# EAGLE design SparkFun_TC78H670FTG_Breakout (EAGLE 9.5.2)
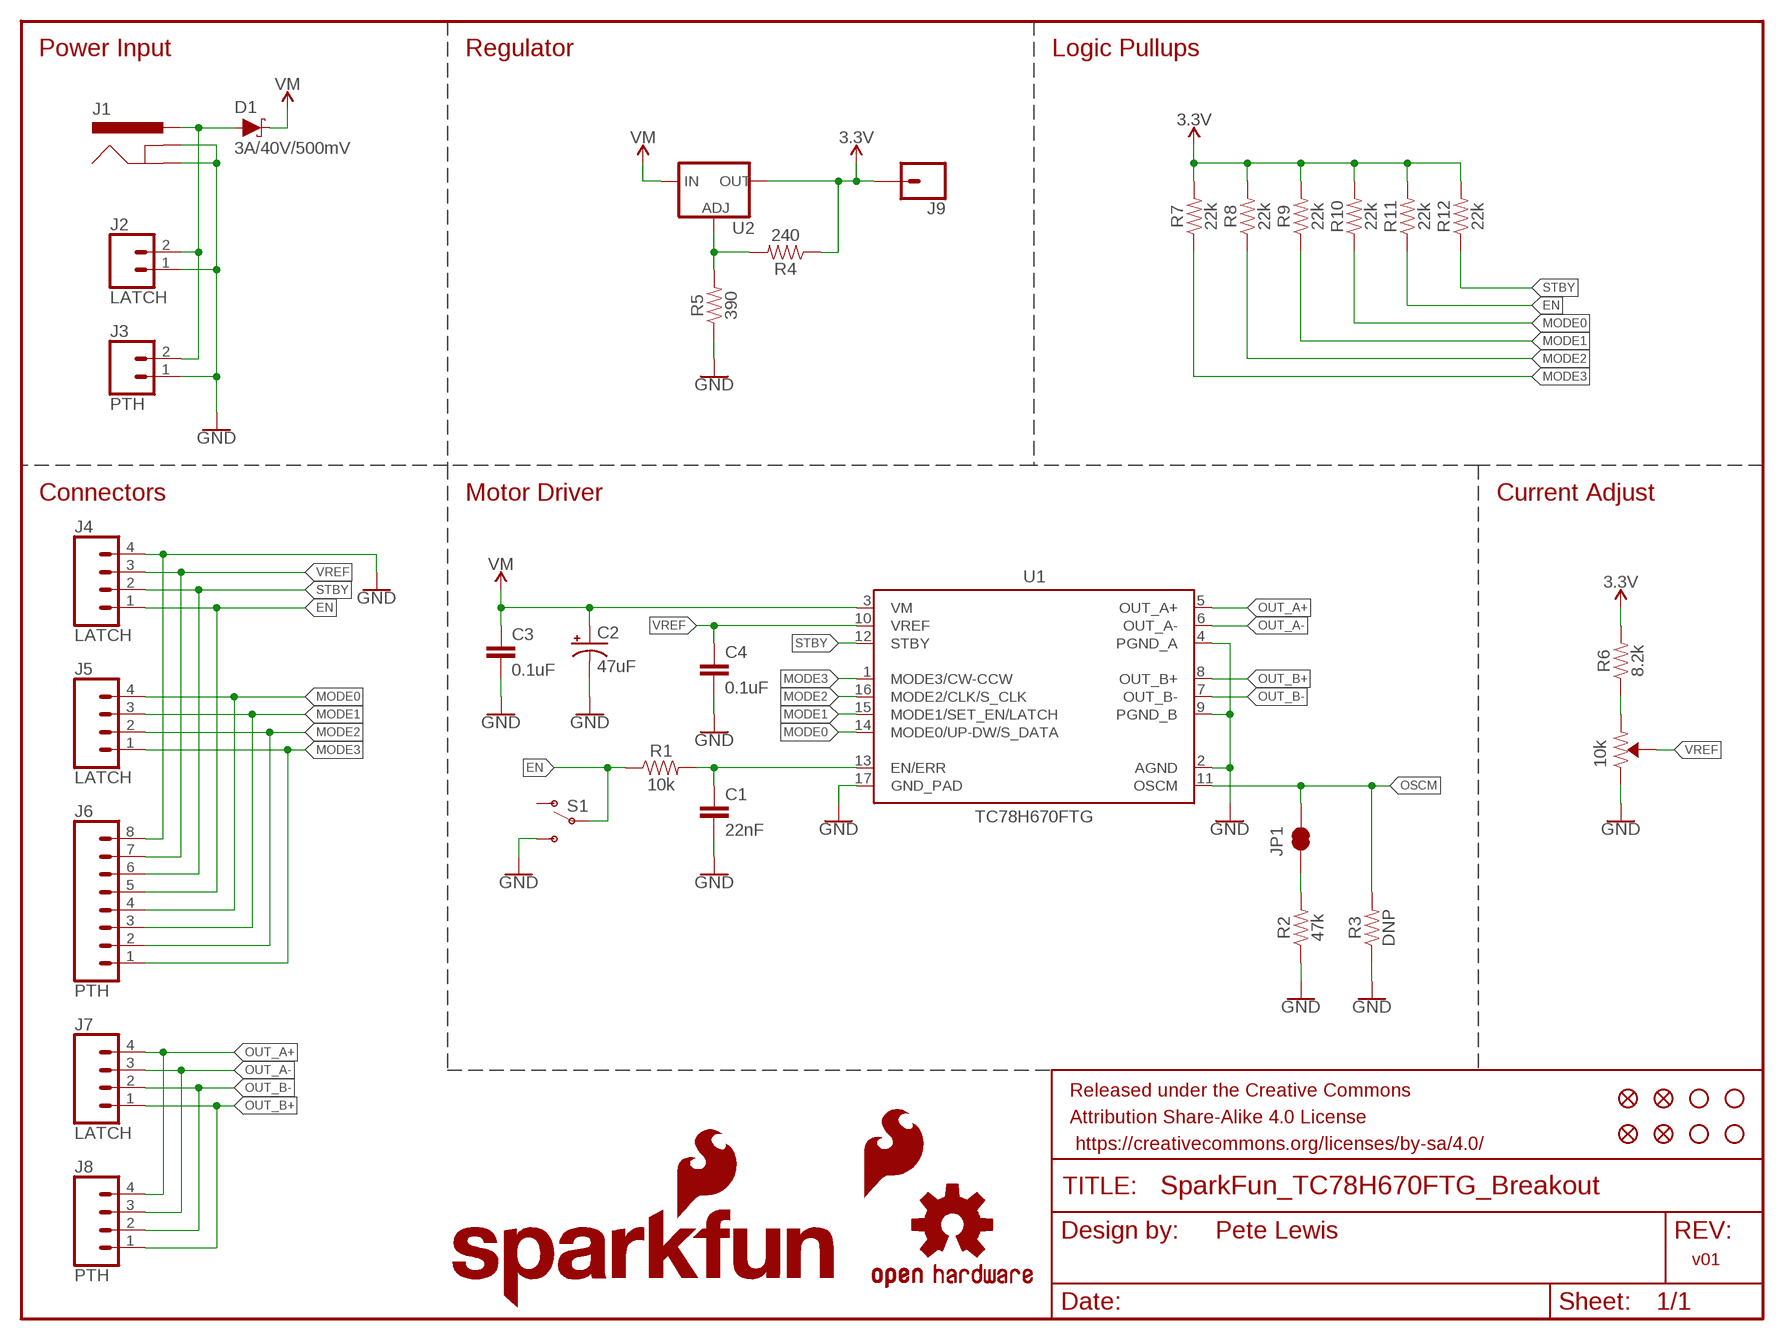
[diagram p0: schematic, sheet 1]

## Parts
C1  22nF  22NF/22,000PF-0603-50V-10%  [0603]
C2  47uF  47UF-POLAR-PANASONIC_D-35V-20%  [PANASONIC_D]
C3  0.1uF  0.1UF-0603-25V-(+80/-20%)  [0603]
C4  0.1uF  0.1UF-0603-25V-(+80/-20%)  [0603]
D1  3A/40V/500mV  DIODE-SCHOTTKY-B340A  [SMA-DIODE]
FID1  FIDUCIAL1X2  [FIDUCIAL-1X2]
FID2  FIDUCIAL1X2  [FIDUCIAL-1X2]
FID3  FIDUCIAL1X2  [FIDUCIAL-1X2]
FID4  FIDUCIAL1X2  [FIDUCIAL-1X2]
FRAME1  FRAME-LETTER  [CREATIVE_COMMONS]
J1  POWER_JACKTOE  [POWER_JACK_SMD_OVERPASTE_TOE]
J2  LATCH  CONN_02LATCH_2  [LATCHTERMINAL-5MM-2]
J3  PTH  CONN_021X02_NO_SILK  [1X02_NO_SILK]
J4  LATCH  CONN_04LATCH  [LATCHTERMINAL-5MM-4]
J5  LATCH  CONN_04LATCH  [LATCHTERMINAL-5MM-4]
J6  PTH  CONN_08NO_SILK_FEMALE_PTH  [1X08_NO_SILK]
J7  LATCH  CONN_04LATCH  [LATCHTERMINAL-5MM-4]
J8  PTH  CONN_041X04_NO_SILK  [1X04_NO_SILK]
J9  CONN_01PTH_NO_SILK_YES_STOP  [1X01_NO_SILK]
JP1  JUMPER-SMT_2_NC_TRACE_SILK  [SMT-JUMPER_2_NC_TRACE_SILK]
LOGO1  SFE_LOGO_NAME_FLAME.1_INCH  [SFE_LOGO_NAME_FLAME_.1]
LOGO2  OSHW-LOGOS  [OSHW-LOGO-S]
LOGO4  SFE_LOGO_FLAME.1_INCH  [SFE_LOGO_FLAME_.1]
R1  10k  10KOHM-0603-1/10W-1%  [0603]
R2  47k  47KOHM-0603-1/10W-1%  [0603]
R3  DNP  RESISTORAXIAL-0.3  [AXIAL-0.3]
R4  240  240OHM-0603-1/10W-1%  [0603]
R5  390  390OHM-0603-1/10W-1%  [0603]
R6  8.2k  8.2KOHM-0603-1/10W-5%  [0603]
R7  22k  22KOHM-0603-1/10W-1%  [0603]
R8  22k  22KOHM-0603-1/10W-1%  [0603]
R9  22k  22KOHM-0603-1/10W-1%  [0603]
R10  22k  22KOHM-0603-1/10W-1%  [0603]
R11  22k  22KOHM-0603-1/10W-1%  [0603]
R12  22k  22KOHM-0603-1/10W-1%  [0603]
S1  SWITCH-SPDT-PTH-11.6X4.0MM-LOCK  [SWITCH_SPDT_PTH_11.6X4.0MM_LOCK]
STANDOFF1  STAND-OFF  [STAND-OFF]
STANDOFF2  STAND-OFF  [STAND-OFF]
STANDOFF3  STAND-OFF  [STAND-OFF]
STANDOFF4  STAND-OFF  [STAND-OFF]
U1  TC78H670FTG  [P-VQFN16-0303-0.50-001]
U2  V_REG_LM1117SOT223  [SOT223]
VR1  10k  TRIMPOT-SMD-3MM-CLOSED-1/8W-20%  [TRIMPOT-SMD-3MM-CLOSED]

## Nets
3.3V: J9.1 R4.1 R6.2 R7.2 R8.2 R9.2 R10.2 R11.2 R12.2 U2.2(OUT) U2.4(OUT)
EN: J4.1 J6.5 R1.1 R11.1 S1.2(P)
GND: C1.2 C2.- C3.2 C4.2 J1.GND(GNDBREAK) J1.P$4(GND) J2.1 J3.1 J4.4 J6.8 R2.1 R3.P$1 R5.1 S1.3(S) U1.2(AGND) U1.4(PGND_A) U1.9(PGND_B) U1.17(GND_PAD) VR1.3(CW)
MODE0: J5.4 J6.4 R10.1 U1.14(MODE0/UP-DW/S_DATA)
MODE1: J5.3 J6.3 R9.1 U1.15(MODE1/SET_EN/LATCH)
MODE2: J5.2 J6.2 R8.1 U1.16(MODE2/CLK/S_CLK)
MODE3: J5.1 J6.1 R7.1 U1.1(MODE3/CW-CCW)
N$1: C1.1 R1.2 U1.13(EN/ERR)
N$2: JP1.1 R2.2
N$3: D1.A J1.VIN0(PWR) J2.2 J3.2
N$4: R4.2 R5.2 U2.1(ADJ)
N$5: R6.1 VR1.1(CCW)
OSCM: JP1.2 R3.P$2 U1.11(OSCM)
OUT_A+: J7.4 J8.4 U1.5(OUT_A+)
OUT_A-: J7.3 J8.3 U1.6(OUT_A-)
OUT_B+: J7.1 J8.1 U1.8(OUT_B+)
OUT_B-: J7.2 J8.2 U1.7(OUT_B-)
STBY: J4.2 J6.6 R12.1 U1.12(STBY)
VM: C2.+ C3.1 D1.C U1.3(VM) U2.3(IN)
VREF: C4.1 J4.3 J6.7 U1.10(VREF) VR1.2(WIPER)
Unconnected: S1.1(O)

## Notes on the sheet
- Power Input | Regulator | Logic Pullups
- Connectors | Motor Driver | Current Adjust
- Pete Lewis
- v01

## Library data of the parts
C1 = SparkFun-Capacitors:22NF/22,000PF: 0.022uF/22nF/22,000pF ceramic capacitors A capacitor is a passive two-terminal electrical component used to store electrical energy temporarily in an electric field.; PROD_ID: CAP-07885
C2 = SparkFun-Capacitors:47UF-POLAR: 47µF polarized capacitors A capacitor is a passive two-terminal electrical component used to store electrical energy temporarily in an electric field.; PROD_ID: CAP-08478
C3 C4 = SparkFun-Capacitors:0.1UF: 0.1µF ceramic capacitors A capacitor is a passive two-terminal electrical component used to store electrical energy temporarily in an electric field.; PROD_ID: CAP-00810
D1 = SparkFun-DiscreteSemi:DIODE-SCHOTTKY: Schottky diode A Schottky diode is a semiconductor diode which has a low forward voltage drop and a very fast switching action.; PROD_ID: DIO-09886
FID1-FID4 = SparkFun-Aesthetics:FIDUCIAL: Fiducial Alignment Points Point-of-reference for pick-and-place machines and other optical instruments.
FRAME1 = SparkFun-Aesthetics:FRAME-LETTER: Schematic Frame - Letter Standard 8.5x11 US Letter frame
J1 = SparkFun-Connectors:POWER_JACK: Power Jack Connector This is the standard 5.5mm barrel jack for power. The PTH is the most common, proven, reliable, footprint. The Slot footprint only works if the mill layer is transmitted to the PCB fab house so be warned. Here are the connectors we sell at SparkFun: DC Barrel Power Jack/Connector <https://www.sparkfun.com/products/119> (PRT-00119) DC Barrel Power Jack/Connector (SMD) <https://www.sparkfun.com/products/12748> (PRT-12748) DC Barrel Jack Adapter - Breadboard Compatible <https://www.sparkfun.com/products/10811> (PRT-10811) It is used on this SparkFun product (and many, many others): SparkFun RedBoard - Programmed with Arduino <https://www.sparkfun.com/products/12757> (DEV-12757) Also, if you need a mating power supply or connector, please check these out: Wall Adapter Power Supply - 9VDC 650mA <https://www.sparkfun.com/products/298> (TOL-00298) DC Barrel Jack Adapter - Male <https://www.sparkfun.com/products/10287> (PRT-10287); PROD_ID: CONN-08106; SF_ID: PRT-12748
J2 = SparkFun-Connectors:CONN_02: Multi connection point. Often used as Generic Header-pin footprint for 0.1 inch spaced/style header connections On any of the 0.1 inch spaced packages, you can populate with these: Break Away Headers - Straight <https://www.sparkfun.com/products/116> (PRT-00116) Break Away Male Headers - Right Angle <https://www.sparkfun.com/products/553> (PRT-00553) Female Headers <https://www.sparkfun.com/products/115> (PRT-00115) Break Away Headers - Machine Pin <https://www.sparkfun.com/products/117> (PRT-00117) Break Away Female Headers - Swiss Machine Pin <https://www.sparkfun.com/products/743> (PRT-00743) For SCREWTERMINALS and SPRING TERMINALS visit here: Screw Terimnals on SparkFun.com <https://www.sparkfun.com/search/results?term=Screw+Terminals> (5mm/3.5mm/2.54mm spacing) This device is also useful as a general connection point to wire up your design to another part of your project. Our various solder wires solder well into these plated through hole pads. Hook-Up Wire - Assortment (Stranded, 22 AWG) <https://www.sparkfun.com/products/11375> (PRT-11375) Hook-Up Wire - Assortment (Solid Core, 22 AWG) <https://www.sparkfun.com/products/11367> (PRT-11367) View the entire wire category on our website here <https://www.sparkfun.com/categories/141> Special notes: Molex polarized connector foot print use with: PRT-08233 with associated crimp pins and housings. 2.54_SCREWTERM for use with PRT-10571. 3.5mm Screw Terminal footprints for PRT-08084 5mm Screw Terminal footprints for use with PRT-08432; PROD_ID: PRT-15898
J3 = SparkFun-Connectors:CONN_02: Multi connection point. Often used as Generic Header-pin footprint for 0.1 inch spaced/style header connections On any of the 0.1 inch spaced packages, you can populate with these: Break Away Headers - Straight <https://www.sparkfun.com/products/116> (PRT-00116) Break Away Male Headers - Right Angle <https://www.sparkfun.com/products/553> (PRT-00553) Female Headers <https://www.sparkfun.com/products/115> (PRT-00115) Break Away Headers - Machine Pin <https://www.sparkfun.com/products/117> (PRT-00117) Break Away Female Headers - Swiss Machine Pin <https://www.sparkfun.com/products/743> (PRT-00743) For SCREWTERMINALS and SPRING TERMINALS visit here: Screw Terimnals on SparkFun.com <https://www.sparkfun.com/search/results?term=Screw+Terminals> (5mm/3.5mm/2.54mm spacing) This device is also useful as a general connection point to wire up your design to another part of your project. Our various solder wires solder well into these plated through hole pads. Hook-Up Wire - Assortment (Stranded, 22 AWG) <https://www.sparkfun.com/products/11375> (PRT-11375) Hook-Up Wire - Assortment (Solid Core, 22 AWG) <https://www.sparkfun.com/products/11367> (PRT-11367) View the entire wire category on our website here <https://www.sparkfun.com/categories/141> Special notes: Molex polarized connector foot print use with: PRT-08233 with associated crimp pins and housings. 2.54_SCREWTERM for use with PRT-10571. 3.5mm Screw Terminal footprints for PRT-08084 5mm Screw Terminal footprints for use with PRT-08432
J4 J5 J7 = SparkFun-Connectors:CONN_04: Multi connection point. Often used as Generic Header-pin footprint for 0.1 inch spaced/style header connections On any of the 0.1 inch spaced packages, you can populate with these: Break Away Headers - Straight <https://www.sparkfun.com/products/116> (PRT-00116) Break Away Male Headers - Right Angle <https://www.sparkfun.com/products/553> (PRT-00553) Female Headers <https://www.sparkfun.com/products/115> (PRT-00115) Break Away Headers - Machine Pin <https://www.sparkfun.com/products/117> (PRT-00117) Break Away Female Headers - Swiss Machine Pin <https://www.sparkfun.com/products/743> (PRT-00743) For SCREWTERMINALS and SPRING TERMINALS visit here: Screw Terimnals on SparkFun.com <https://www.sparkfun.com/search/results?term=Screw+Terminals> (5mm/3.5mm/2.54mm spacing) This device is also useful as a general connection point to wire up your design to another part of your project. Our various solder wires solder well into these plated through hole pads. Hook-Up Wire - Assortment (Stranded, 22 AWG) <https://www.sparkfun.com/products/11375> (PRT-11375) Hook-Up Wire - Assortment (Solid Core, 22 AWG) <https://www.sparkfun.com/products/11367> (PRT-11367) View the entire wire category on our website here <https://www.sparkfun.com/categories/141> Special notes: Molex polarized connector foot print use with SKU : PRT-08231 with associated crimp pins and housings. 1MM SMD Version SKU: PRT-10208; PROD_ID: PRT-15900
J6 = SparkFun-Connectors:CONN_08: Multi connection point. Often used as Generic Header-pin footprint for 0.1 inch spaced/style header connections On any of the 0.1 inch spaced packages, you can populate with these: Break Away Headers - Straight <https://www.sparkfun.com/products/116> (PRT-00116) Break Away Male Headers - Right Angle <https://www.sparkfun.com/products/553> (PRT-00553) Female Headers <https://www.sparkfun.com/products/115> (PRT-00115) Break Away Headers - Machine Pin <https://www.sparkfun.com/products/117> (PRT-00117) Break Away Female Headers - Swiss Machine Pin <https://www.sparkfun.com/products/743> (PRT-00743) Arduino Stackable Header - 8 Pin <https://www.sparkfun.com/products/9279> (PRT-09279) For SCREWTERMINALS and SPRING TERMINALS visit here: Screw Terimnals on SparkFun.com <https://www.sparkfun.com/search/results?term=Screw+Terminals> (5mm/3.5mm/2.54mm spacing) This device is also useful as a general connection point to wire up your design to another part of your project. Our various solder wires solder well into these plated through hole pads. Hook-Up Wire - Assortment (Stranded, 22 AWG) <https://www.sparkfun.com/products/11375> (PRT-11375) Hook-Up Wire - Assortment (Solid Core, 22 AWG) <https://www.sparkfun.com/products/11367> (PRT-11367) View the entire wire category on our website here <https://www.sparkfun.com/categories/141> Special notes: Molex polarized connector foot print use with SKU : PRT-08231 with associated crimp pins and housings. 1MM SMD Version SKU: PRT-10208 NOTES ON THE VARIANTS LOCK and LOCK_LONGPADS... This footprint was designed to help hold the alignment of a through-hole component (i.e. 6-pin header) while soldering it into place. You may notice that each hole has been shifted either up or down by 0.005 of an inch from it's more standard position (which is a perfectly straight line). This slight alteration caused the pins (the squares in the middle) to touch the edges of the holes. Because they are alternating, it causes a "brace" to hold the component in place. 0.005 has proven to be the perfect amount of "off-center" position when using our standard breakaway headers. Although looks a little odd when you look at the bare footprint, once you have a header in there, the alteration is very hard to notice. Also,if you push a header all the way into place, it is covered up entirely on the bottom side.; PROD_ID: CONN-08438
J8 = SparkFun-Connectors:CONN_04: Multi connection point. Often used as Generic Header-pin footprint for 0.1 inch spaced/style header connections On any of the 0.1 inch spaced packages, you can populate with these: Break Away Headers - Straight <https://www.sparkfun.com/products/116> (PRT-00116) Break Away Male Headers - Right Angle <https://www.sparkfun.com/products/553> (PRT-00553) Female Headers <https://www.sparkfun.com/products/115> (PRT-00115) Break Away Headers - Machine Pin <https://www.sparkfun.com/products/117> (PRT-00117) Break Away Female Headers - Swiss Machine Pin <https://www.sparkfun.com/products/743> (PRT-00743) For SCREWTERMINALS and SPRING TERMINALS visit here: Screw Terimnals on SparkFun.com <https://www.sparkfun.com/search/results?term=Screw+Terminals> (5mm/3.5mm/2.54mm spacing) This device is also useful as a general connection point to wire up your design to another part of your project. Our various solder wires solder well into these plated through hole pads. Hook-Up Wire - Assortment (Stranded, 22 AWG) <https://www.sparkfun.com/products/11375> (PRT-11375) Hook-Up Wire - Assortment (Solid Core, 22 AWG) <https://www.sparkfun.com/products/11367> (PRT-11367) View the entire wire category on our website here <https://www.sparkfun.com/categories/141> Special notes: Molex polarized connector foot print use with SKU : PRT-08231 with associated crimp pins and housings. 1MM SMD Version SKU: PRT-10208; PROD_ID: CONN-09696
J9 = SparkFun-Connectors:CONN_01: Single connection point. Often used as Generic Header-pin footprint for 0.1 inch spaced/style header connections On any of the 0.1 inch spaced packages, you can populate with these: Break Away Headers - Straight <https://www.sparkfun.com/products/116> (PRT-00116) Break Away Male Headers - Right Angle <https://www.sparkfun.com/products/553> (PRT-00553) Female Headers <https://www.sparkfun.com/products/115> (PRT-00115) Break Away Headers - Machine Pin <https://www.sparkfun.com/products/117> (PRT-00117) Break Away Female Headers - Swiss Machine Pin <https://www.sparkfun.com/products/743> (PRT-00743) This device is also useful as a general connection point to wire up your design to another part of your project. Our various solder wires solder well into these plated through hole pads. Hook-Up Wire - Assortment (Stranded, 22 AWG) <https://www.sparkfun.com/products/11375> (PRT-11375) Hook-Up Wire - Assortment (Solid Core, 22 AWG) <https://www.sparkfun.com/products/11367> (PRT-11367) View the entire wire category on our website here <https://www.sparkfun.com/categories/141> Special notes: SMTSO-256-ET is a "flush mount" nut for a 4-40 screw. We mostly use this on specialty testbeds; it is a nice way to connect hardware to your PCB at an adjustable hieght. Also note, the SNAP packages are for using a snappable style connector. We sell a baggie of snaps and they are also used on two LilyPad designs: Snap Assortment - 30 pack (male and female) <https://www.sparkfun.com/products/11347> (DEV-11347) LilyPad Arduino SimpleSnap <https://www.sparkfun.com/products/10941> (DEV-10941) LilyPad SimpleSnap Protoboard <https://www.sparkfun.com/products/10940> (DEV-10940)
JP1 = SparkFun-Jumpers:JUMPER-SMT_2_NC_TRACE: Normally closed trace jumper This jumper has a trace between two pads so it's normally closed (NC). Use a razor knife to open the connection. For best results follow the IPC guidelines for cutting traces: Cutout at least 0.063 mm (0.005 in). Remove all loose material to clean up the cut area. Seal the cut with an approved epoxy. Reapply solder to reclose the connection.
LOGO1 = SparkFun-Aesthetics:SFE_LOGO_NAME_FLAME: SparkFun Font Logo w/ Flame This is the SparkFun full logo. The logo on the schematic will always be the same size; the package variant is the height of the flame part of the logo. Default layer for the logo on the board is tSilk.
LOGO2 = SparkFun-Aesthetics:OSHW-LOGO: Open-Source Hardware (OSHW) Logo This logo indicates the piece of hardware it is found on incorporates a OSHW license and/or adheres to the definition of open source hardware found here: http://freedomdefined.org/OSHW
LOGO4 = SparkFun-Aesthetics:SFE_LOGO_FLAME: SparkFun Flame Logo This is the SparkFun flame logo. The logo on the schematic will always be the same size; the package variant is the height of the flame. Default layer for the logo on the board is tSilk.
R1 = SparkFun-Resistors:10KOHM: 10kΩ resistor A resistor is a passive two-terminal electrical component that implements electrical resistance as a circuit element. Resistors act to reduce current flow, and, at the same time, act to lower voltage levels within circuits. - Wikipedia; PROD_ID: RES-00824
R2 = SparkFun-Resistors:47KOHM: 47kΩ resistor A resistor is a passive two-terminal electrical component that implements electrical resistance as a circuit element. Resistors act to reduce current flow, and, at the same time, act to lower voltage levels within circuits. - Wikipedia; PROD_ID: RES-07871
R3 = SparkFun-Resistors:RESISTOR: Generic Resistor Package
R4 = SparkFun-Resistors:240OHM: 240Ω resistor A resistor is a passive two-terminal electrical component that implements electrical resistance as a circuit element. Resistors act to reduce current flow, and, at the same time, act to lower voltage levels within circuits. - Wikipedia; PROD_ID: RES-07849
R5 = SparkFun-Resistors:390OHM: 390Ω resistor A resistor is a passive two-terminal electrical component that implements electrical resistance as a circuit element. Resistors act to reduce current flow, and, at the same time, act to lower voltage levels within circuits. - Wikipedia; PROD_ID: RES-07864
R6 = SparkFun-Resistors:8.2KOHM: 8.2kΩ resistor A resistor is a passive two-terminal electrical component that implements electrical resistance as a circuit element. Resistors act to reduce current flow, and, at the same time, act to lower voltage levels within circuits. - Wikipedia; PROD_ID: RES-10646
R7-R12 = SparkFun-Resistors:22KOHM: 22kΩ resistor A resistor is a passive two-terminal electrical component that implements electrical resistance as a circuit element. Resistors act to reduce current flow, and, at the same time, act to lower voltage levels within circuits. - Wikipedia; PROD_ID: RES-07853
S1 = SparkFun-Switches:SWITCH-SPDT: Single Pole, Double Throw (SPDT) Switch Single-pole, double-throw (SPDT) switch. Variant Overview SMD-AYZ0202 Surface Mount DPDT Switch <https://www.sparkfun.com/products/597> (COM-00597) Used on e.g. LilyPad Arduino USB - ATmega32U4 Board <https://www.sparkfun.com/products/12049> PTH-11.6X4.0MM SPDT Mini Power Switch <https://www.sparkfun.com/products/102> (COM-00102) Used on e.g. SparkFun Simon Says - Through-Hole Soldering Kit <https://www.sparkfun.com/products/10547> (KIT-10547) PTH-11.6X4.0MM-KIT KIT version of SPDT Mini Power Switch - Simplifies soldering by removing tStop of switch pins - only one side can be soldered. PTH-11.6X4.0MM-LOCK LOCK version of SPDT Mini Power Switch - Offset pins hold switch in place for easier soldering. SMD-RIGHT-ANGLE Surface Mount Right Angle Switch <https://www.sparkfun.com/products/10860> (COM-10860) Used on e.g. SparkFun ESP8266 Thing <https://www.sparkfun.com/products/13231>; PROD_ID: SWCH-08261; SF_SKU: COM-00102
STANDOFF1-STANDOFF4 = SparkFun-Electromechanical:STAND-OFF: #4 Stand Off This is the mechanical footprint for a #4 phillips button head screw. Use the keepout ring to avoid running the screw head into surrounding components. SKU : PRT-00447
U1 = TC78H670FTG:TC78H670FTG; PROD_ID: IC-15170
U2 = SparkFun-IC-Power:V_REG_LM1117: Voltage Regulator LM1117 Standard adjustable voltage regulator but in SMD form. Spark Fun Electronics SKU : COM-00595; PROD_ID: VREG-08170
VR1 = SparkFun-Resistors:TRIMPOT: Trimming Potentiometer (Trimpot) Three-terminal potentiometers, with an adjustable wiper and two adjustable resistors. A pot can be used to create a configurable voltage divider, or as a variable resistor. "Trimpots" are a subset of potentiometers, usually intended for "set-and-forget" applications. They're often more delicate than standard potentiometers - rated for fewer turns. Variants PTH-KNOB - PTH Trimpot w/ finger-adjustable knob Trimpot 10K with Knob <https://www.sparkfun.com/products/9806> (COM-09806) Datasheet <http://www.sparkfun.com/datasheets/Components/General/TSR-3386.pdf> SMD-3MM-CLOSED-FRAME - SMD 3mm Square Closed-Frame Trimpot Used on e.g. EasyDriver - Stepper Motor Driver <https://www.sparkfun.com/products/12779> Datasheet <http://www.bitechnologies.com/pdfs/22.pdf> (22AR10KTR) SMD-5MM - SMD 5mm Square Closed-Frame Trimpot Used on e.g. IOIO-OTG - V2.2 <https://www.sparkfun.com/products/13613> Datasheet <http://www.vishay.com/docs/51008/ts53.pdf> (TS53YL502MR10) SMD-3MM-1/10W-25% - 3mm Square Open-Frame Trimpot Used on e.g. SparkFun Shapeoko <https://www.sparkfun.com/products/13899> Datasheet <http://www.bourns.com/docs/Product-Datasheets/TC33.pdf> (TC33X-2-103E); PROD_ID: RES-09285

## Net classes
1 power: width 0.203 mm

## Board
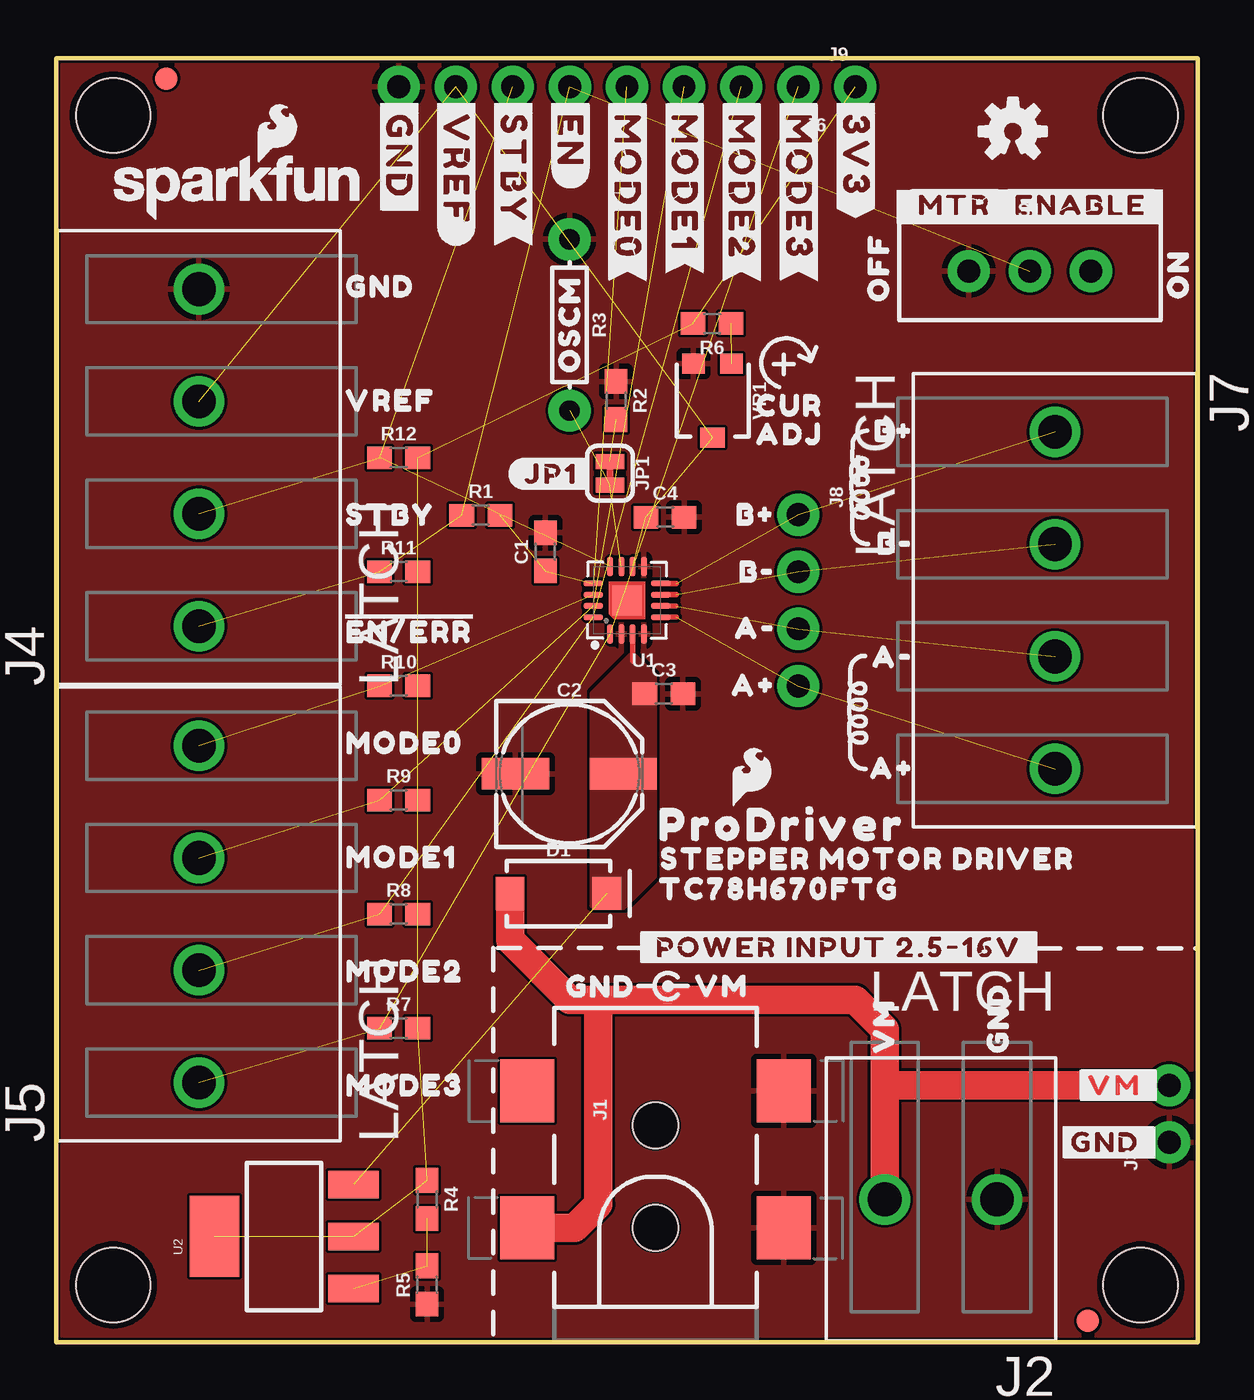
[diagram p1: board, top side]
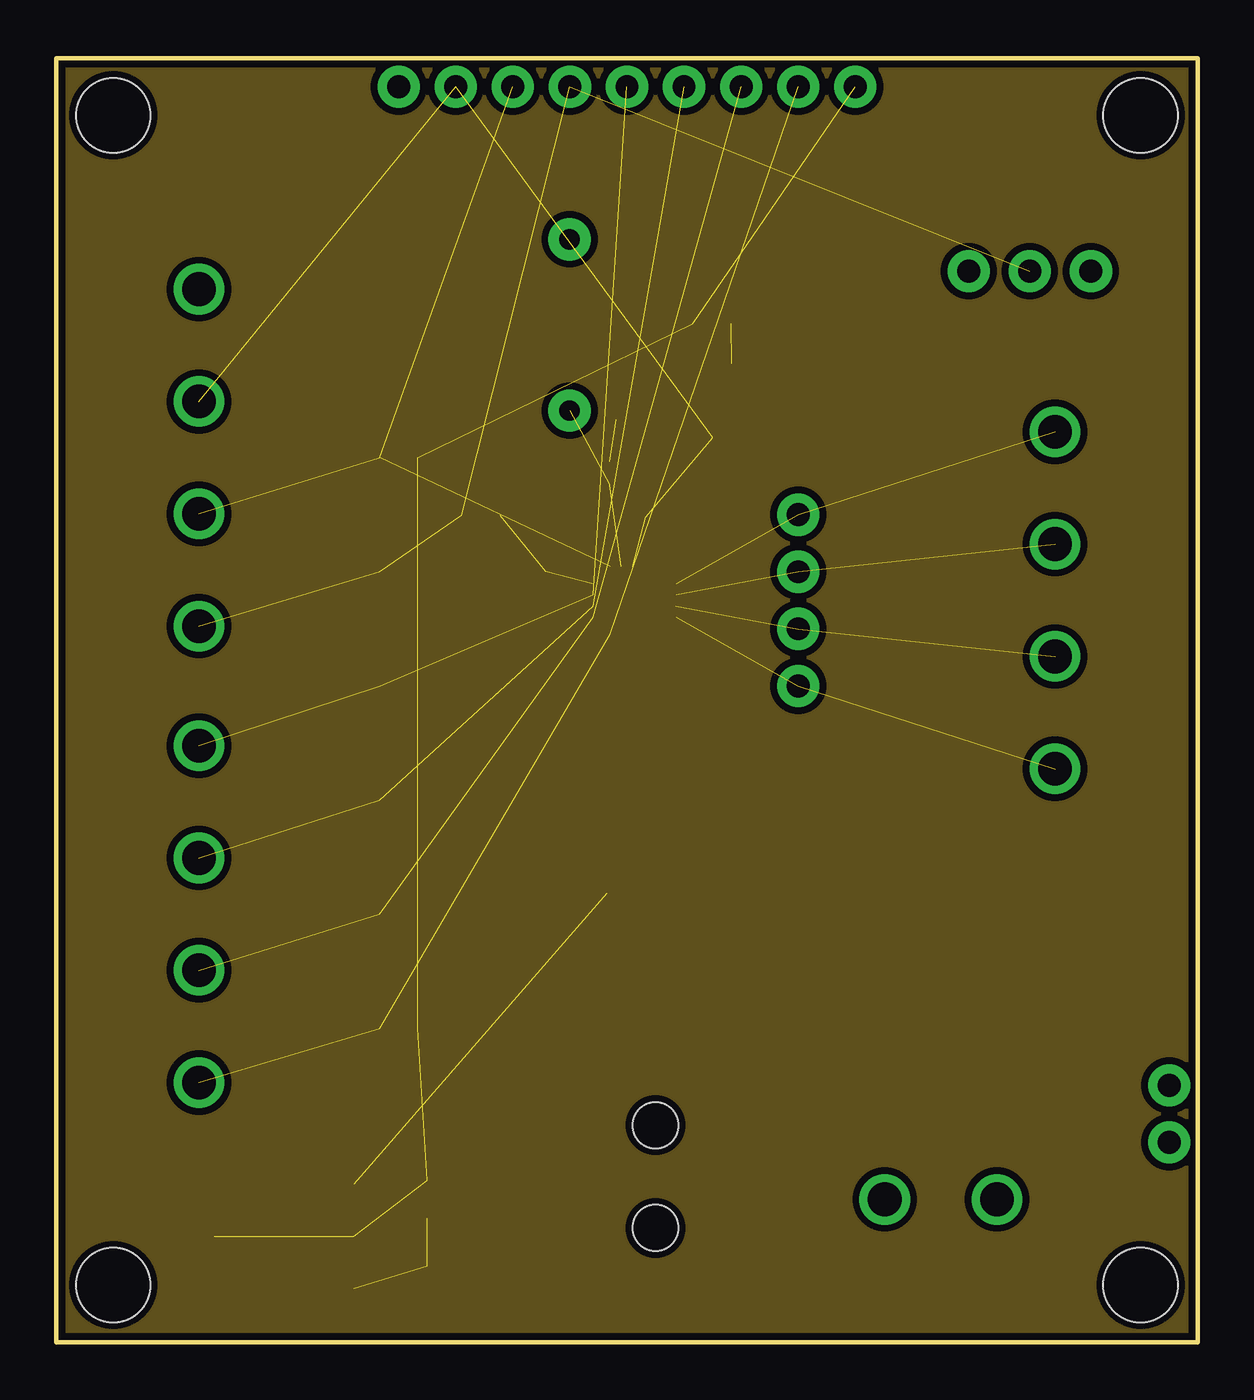
[diagram p2: board, inner layer VM]
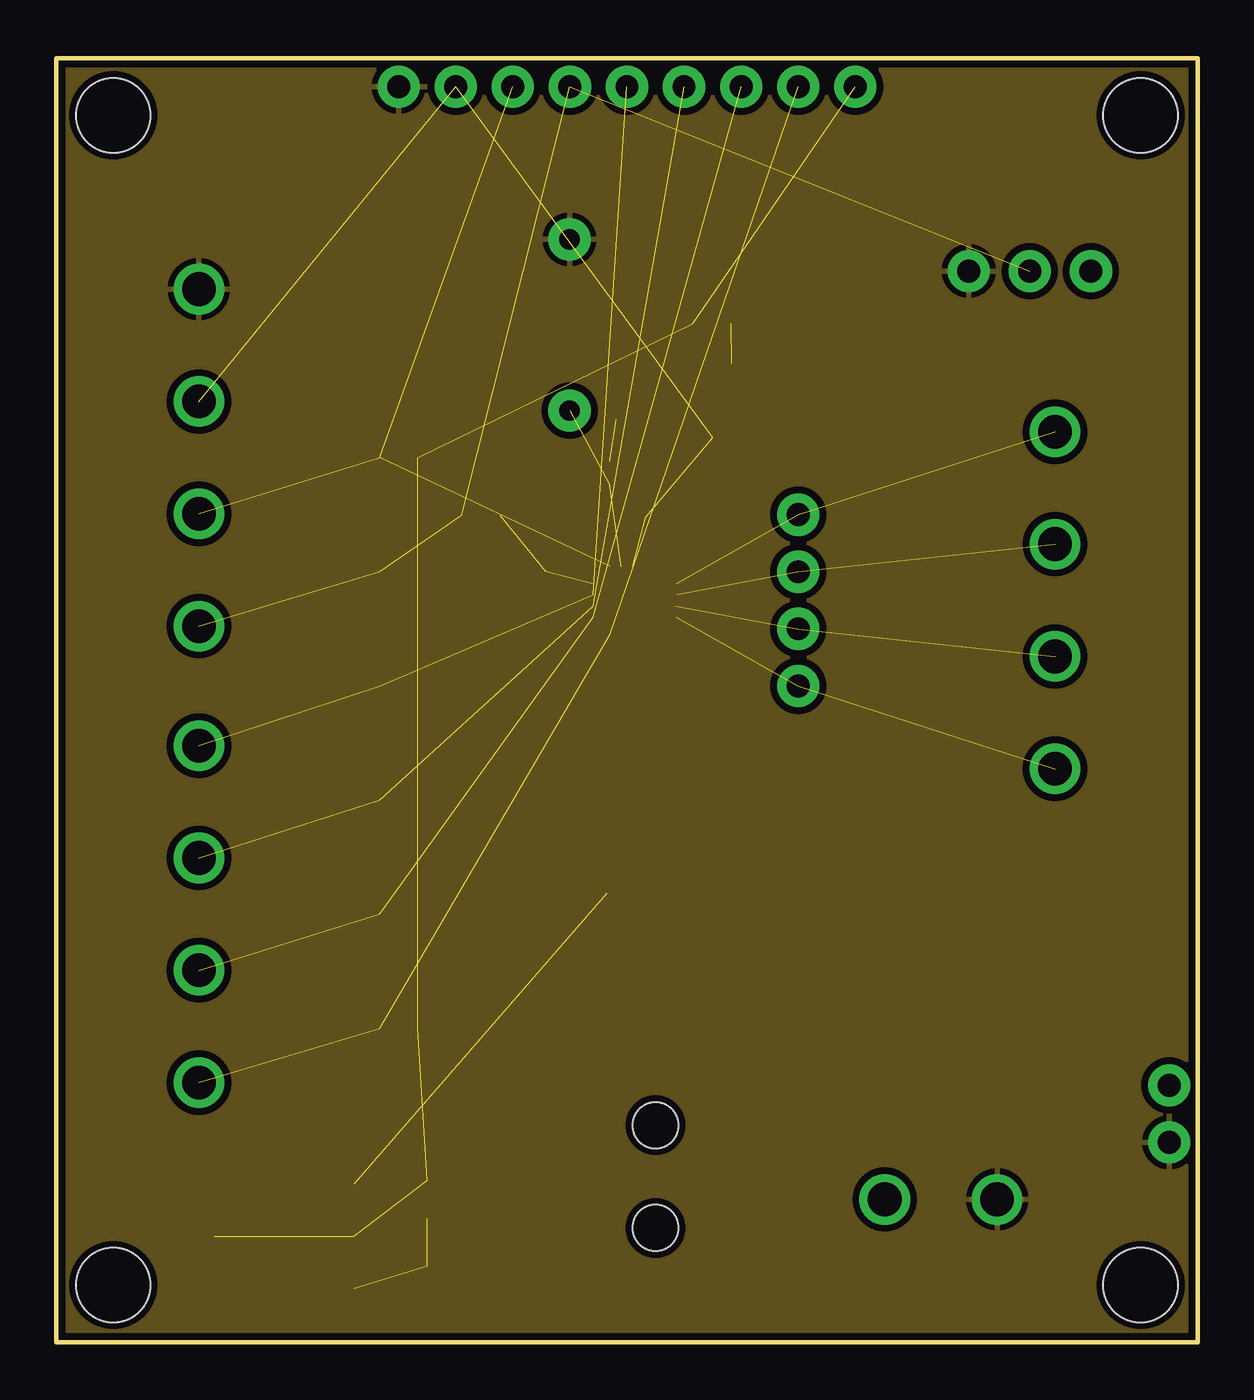
[diagram p3: board, inner layer GND]
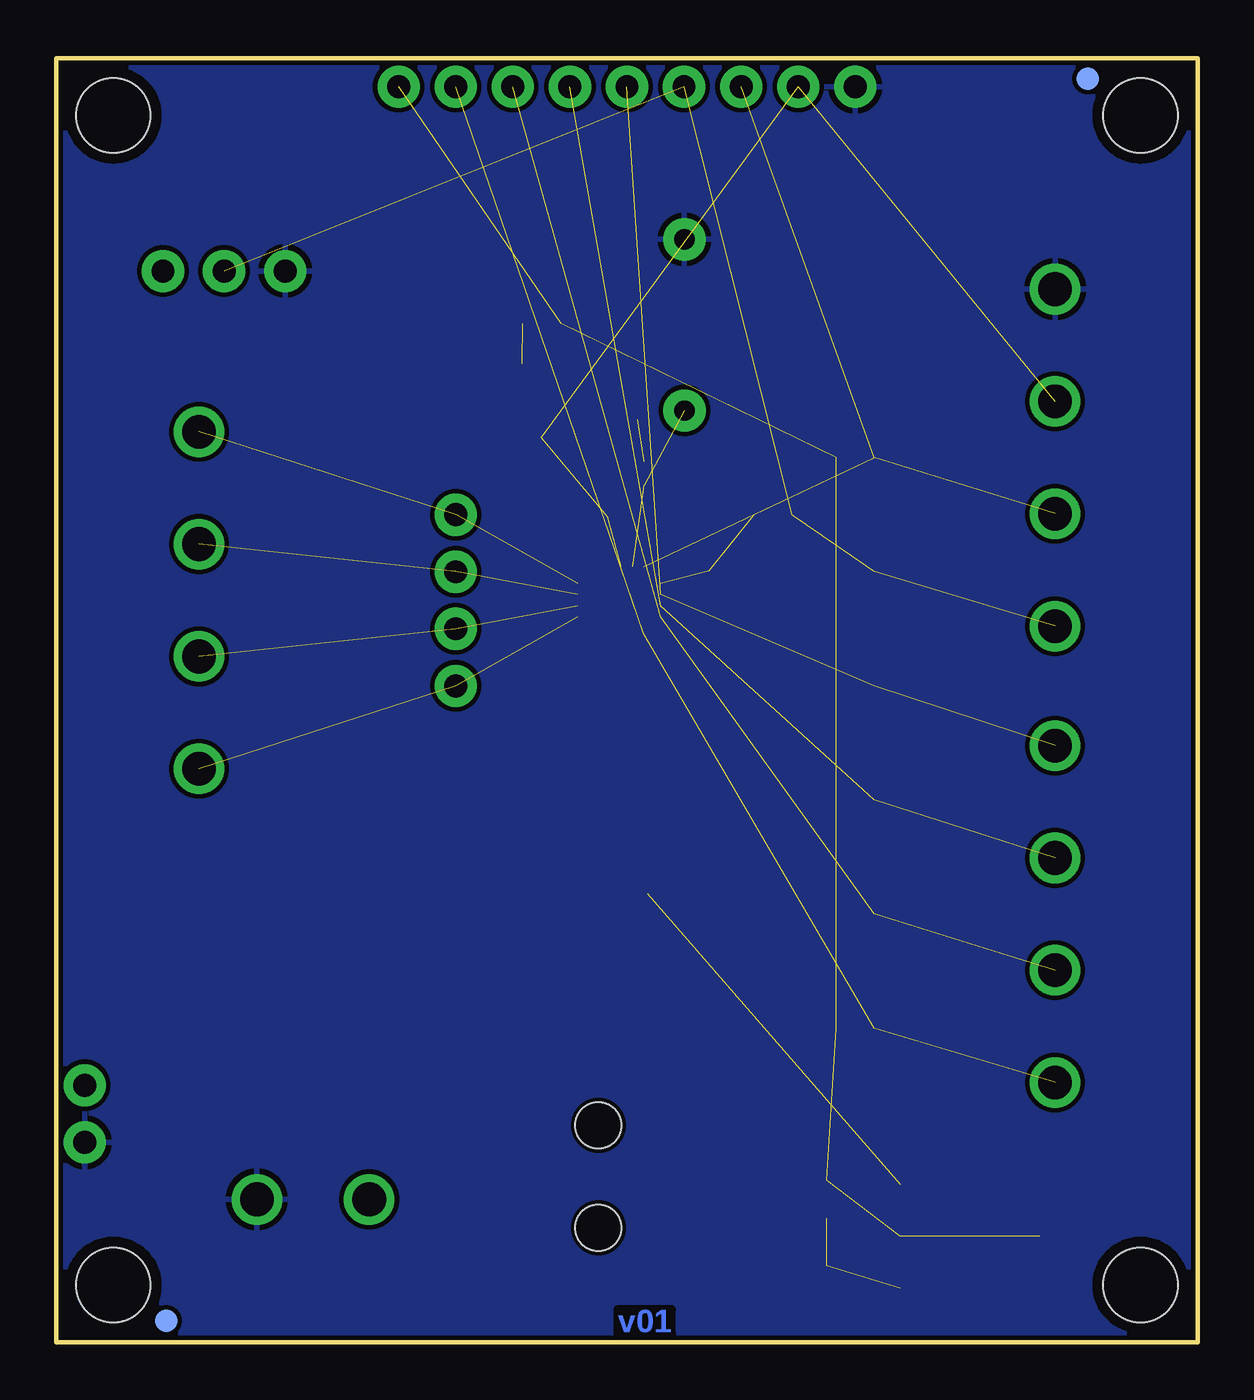
[diagram p4: board, bottom side, seen from below]

Size 50.8 x 57.15 mm. Coordinates in mm from the lower left corner, seen from the top.
Outline: 50.8,57.15 50.8,0 0,0 0,57.15 50.8,57.15
Copper layers (1*2*15*16): Top 0.035559375mm / dielectric 0.47751875mm / VM 0.035559375mm / dielectric 0.47751875mm / GND 0.035559375mm / dielectric 0.47751875mm / Bottom 0.035559375mm
Design rules "SparkFun-4-layer-FAB-LIMIT": minimum track width 4mil, minimum drill 6mil, track to track 5mil, track to pad 5mil, pad to pad 5mil, via to via 5mil, smd to smd 5mil, copper to edge 4mil, drill to drill 4mil, minimum pad ring 5mil, minimum via ring 5mil, stop-mask expansion 4mil, vias tented up to drill 25mil, thermal gap 10mil
tRestrict: area 26.5,31.4 to 26.5,31.6; area 26.5,34.5 to 26.5,34.6

### Footprints (pad centres in the part's own frame; a part is rotated, then mirrored left to right if it is on the bottom)
0603 = smd 1.1 x 1: 1 -0.85,0; 2 0.85,0
PANASONIC_D = smd 3 x 1.4: + 2.4,0; - -2.4,0
SMA-DIODE = smd 1.27 x 1.47: A -2.15,0; C 2.15,0
FIDUCIAL-1X2 = smd 1 x 1: 1 0,0
POWER_JACK_SMD_OVERPASTE_TOE = smd 2.8 x 2.4: GND 0,-5.7; P$4 6.1,-5.7; VIN0 0,5.7; VIN1 6.1,5.7 | hole 2.032: 0,0; 4.572,0
LATCHTERMINAL-5MM-2 = drill 1.5: 1 -2.5,0; 2 2.5,0
1X02_NO_SILK = drill 1.016 pad 1.88: 1 0,0; 2 2.54,0
LATCHTERMINAL-5MM-4 = drill 1.5: 1 -7.5,0; 2 -2.5,0; 3 2.5,0; 4 7.5,0
1X08_NO_SILK = drill 1.016 pad 1.88: 1 0,0; 2 2.54,0; 3 5.08,0; 4 7.62,0; 5 10.16,0; 6 12.7,0; 7 15.24,0; 8 17.78,0
1X04_NO_SILK = drill 1.016 pad 1.88: 1 0,0; 2 2.54,0; 3 5.08,0; 4 7.62,0
1X01_NO_SILK = drill 1.016 pad 1.88: 1 0,0
SMT-JUMPER_2_NC_TRACE_SILK = smd 0.66 x 1.27: 1 -0.521,0; 2 0.521,0
AXIAL-0.3 = drill 0.9 pad 1.88: P$1 -3.81,0; P$2 3.81,0
SWITCH_SPDT_PTH_11.6X4.0MM_LOCK = drill 1.016 pad 1.88: 1 0,2.718; 2 0,0; 3 0,-2.718
STAND-OFF = hole 3.302: 0,0
P-VQFN16-0303-0.50-001 = smd 0.255 x 0.85: 1 0.75,1.498; 2 0.25,1.498; 3 -0.25,1.498; 4 -0.75,1.498; 9 -0.75,-1.506; 10 -0.25,-1.506; 11 0.25,-1.506; 12 0.75,-1.506 | smd 0.85 x 0.255: 5 -1.508,0.75; 6 -1.5,0.25; 7 -1.508,-0.25; 8 -1.508,-0.75; 13 1.496,-0.75; 14 1.496,-0.25; 15 1.496,0.25; 16 1.496,0.75 | smd 1.3 x 1.3: 17 0,0
SOT223 = smd 1.219 x 2.235: 1 -2.311,-3.099; 2 0,-3.099; 3 2.311,-3.099 | smd 3.6 x 2.2: 4 0,3.099
TRIMPOT-SMD-3MM-CLOSED = smd 1 x 0.9: 1 -0.85,-1.65; 3 0.85,-1.65 | smd 1.1 x 0.9: 2 0,1.65

### Placement (x,y rotation side)
C1  21.77,35.18 90 top
C2  22.83,25.29 0 top
C3  27.04,28.85 0 top
C4  27.09,36.72 0 top
D1  22.35,19.96 0 top
FID1  4.9,56.24 90 top
FID2  45.91,0.94 90 top
FID3  4.9,56.24 0 bottom
FID4  45.91,0.94 0 bottom
FRAME1  -2.54,-16.51 0 top  (outside the outline)
J1  26.67,5.08 90 top
J2  39.37,6.35 180 top
J3  49.53,8.89 90 top
J4  6.35,39.37 90 top
J5  6.35,19.05 90 top
J6  33.02,55.88 180 top
J7  44.45,33.02 270 top
J8  33.02,36.83 270 top
J9  35.56,55.88 0 top
JP1  24.64,38.68 270 top
LOGO1  8.11,51.41 0 top
LOGO2  42.58,53.89 0 top
LOGO4  30.94,25.18 0 top
R1  18.9,36.8 0 top
R2  24.91,41.91 270 top
R3  22.84,45.28 270 top
R4  16.51,6.35 270 top
R5  16.51,2.54 90 top
R6  29.18,45.34 180 top
R7  15.24,13.97 0 top
R8  15.24,19.05 0 top
R9  15.24,24.13 0 top
R10  15.24,29.21 0 top
R11  15.24,34.29 0 top
R12  15.24,39.37 0 top
S1  43.33,47.68 270 top
STANDOFF1  2.54,54.61 90 top
STANDOFF2  48.26,54.61 90 top
STANDOFF3  48.26,2.54 90 top
STANDOFF4  2.54,2.54 90 top
U1  25.4,33.02 180 top
U2  10.13,4.7 90 top
U$1  [A#2]  38.85,25.55 0 top
U$2  [B#0]  38.84,35.54 0 top
U$3  [B#1]  38.84,40.56 0 top
U$4  [A#3]  38.84,30.5 0 top
U$5  [GND6]  12.19,46.99 0 top
U$6  [TC78H670FTG0]  26.13,20.17 0 top
U$7  [VREF7]  12.19,41.91 0 top
U$8  [STBY8]  12.19,36.83 0 top
U$9  [STEPPER_MOTOR_DRIVER0]  26.2,21.51 0 top
U$10  [CUR0]  30.45,41.68 0 top
U$11  [VM10]  36.83,12.19 90 top
U$12  [GND6]  41.91,12.19 90 top
U$13  [#JP1#0]  20.13,38.65 0 top
U$14  [#MTR#0]  37.66,50.61 0 top
U$15  [B#1]  32.68,36.84 0 top
U$16  [ON0]  49.93,45.77 90 top
U$17  [OFF0]  36.6,45.64 90 top
U$18  [OSCM0]  22.84,42.48 90 top
U$19  [#EN#ERR#0]  12.19,31.75 0 top
U$20  [ADJ0]  30.45,40.41 0 top
U$21  [#ENABLE#0]  41.96,50.61 0 top
U$22  [CURRENT_ADJUST]  31.29,42.39 0 top
U$23  [MODE30]  12.19,11.43 0 top
U$24  [MODE10]  12.19,21.59 0 top
U$25  [MODE20]  12.19,16.51 0 top
U$26  [MODE00]  12.19,26.67 0 top
U$27  [#GND_#0]  44.45,8.89 0 top
U$28  [#VM_#0]  45.21,11.43 0 top
U$29  [GND6]  22,15.82 0 top
U$30  [VM10]  27.74,15.85 0 top
U$31  [#GND#0]  15.27,55.55 270 top
U$32  [#VREF#0]  17.81,55.55 270 top
U$33  [#STBY#0]  20.35,55.55 270 top
U$34  [#EN#0]  22.89,55.55 270 top
U$35  [#MODE0#0]  25.43,55.55 270 top
U$36  [#MODE1#0]  27.97,55.55 270 top
U$37  [#MODE2#0]  30.51,55.55 270 top
U$38  [#MODE3#0]  33.05,55.55 270 top
U$39  [#3V3#0]  35.59,55.55 270 top
U$40  [PRODRIVER0]  25.76,23.04 0 top
U$41  [#_POWER_INPUT_2#5#16V_#0]  25.65,17.57 0 top
U$42  [B#0]  32.7,34.3 0 top
U$43  [A#3]  32.72,31.78 0 top
U$44  [A#2]  32.69,29.24 0 top
VR1  29.21,41.91 180 top

### Tracks (layer width: path | path; a pad name or v marks a point on that pad's centre or on a via)
3.3V  (10 unrouted)
EN  (4 unrouted)
GND
  pour Top (rank 6): 0,57.15 0,0 50.8,0 50.8,57.15
  pour Bottom (isolate 0.203, rank 6): 0,57.15 0,0 50.8,0 50.8,57.15
  pour GND (isolate 0.305): 0,0 0,57.15 50.8,57.15 50.8,0
MODE0  (3 unrouted)
MODE1  (3 unrouted)
MODE2  (3 unrouted)
MODE3  (3 unrouted)
N$1  (2 unrouted)
N$2  (1 unrouted)
N$3
  Top 1.27: J3.2 36.99,11.43 36.87,11.55 | D1.A 20.2,17.9 22.86,15.24 24.13,15.24 | 24.13,15.24 35.56,15.24 36.87,13.93 36.87,11.55 | J1.VIN0 23.07,5.08 24.13,6.14 24.13,15.24 | J2.2 36.87,11.55
N$4  (2 unrouted)
N$5  (1 unrouted)
OSCM  (2 unrouted)
OUT_A+  (2 unrouted)
  Top 0.254: U1.5 27.58,32.27
OUT_A-  (2 unrouted)
  Top 0.254: U1.6 27.58,32.77
OUT_B+  (2 unrouted)
  Top 0.254: U1.8 27.59,33.77
OUT_B-  (2 unrouted)
  Top 0.254: U1.7 27.59,33.27 27.59,33.28
STBY  (3 unrouted)
VM  (1 unrouted)
  Top 0.254: U1.3 25.65,30.32
  pour VM (isolate 0.305): 0,0 0,57.15 50.8,57.15 50.8,0
  pour Top (no thermals): 23.84,19.42 23.84,28.86 25.55,30.58 25.72,30.58 26.64,29.66 26.64,20.73 25.23,19.32 23.94,19.32
VREF  (4 unrouted)

### Text on the board
Bottom: v01
tDocu: Pete Lewis